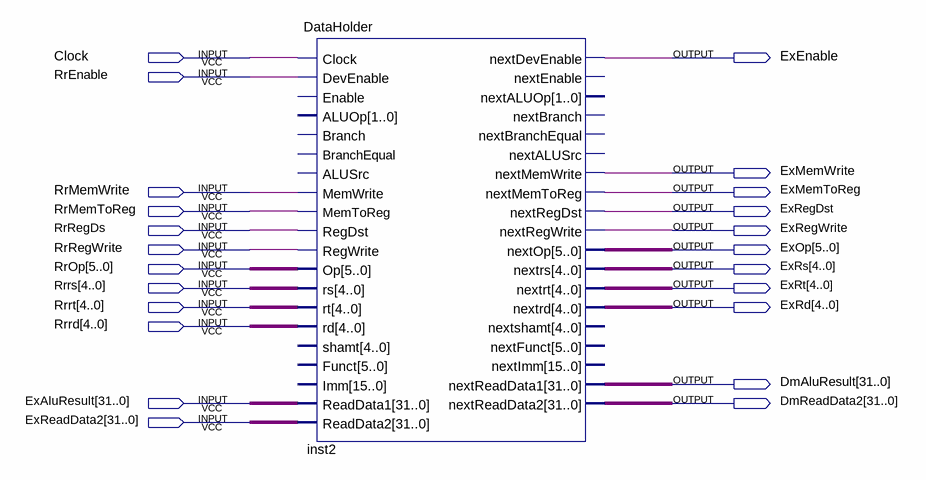
[diagram p0: schematic sheet]
// Quartus schematic ExStage.bdf as structural Verilog: 1 symbols, 23 pins
module ExStage (
  input  Clock,
  input  RrEnable,
  input  RrMemWrite,
  input  RrMemToReg,
  input  RrRegDs,
  input  RrRegWrite,
  input  [5:0] RrOp,
  input  [4:0] Rrrs,
  input  [4:0] Rrrt,
  input  [4:0] Rrrd,
  input  [31:0] ExAluResult,
  input  [31:0] ExReadData2,
  output ExEnable,
  output ExMemWrite,
  output ExMemToReg,
  output ExRegDst,
  output ExRegWrite,
  output [5:0] ExOp,
  output [4:0] ExRs,
  output [4:0] ExRt,
  output [4:0] ExRd,
  output [31:0] DmAluResult,
  output [31:0] DmReadData2
);

  DataHolder inst2 (
    .Clock(Clock), .DevEnable(RrEnable), .MemWrite(RrMemWrite), .MemToReg(RrMemToReg), .RegDst(RrRegDs),
    .RegWrite(RrRegWrite), .Op(RrOp), .rs(Rrrs), .rt(Rrrt), .rd(Rrrd), .ReadData1(ExAluResult),
    .ReadData2(ExReadData2), .nextDevEnable(ExEnable), .nextMemWrite(ExMemWrite), .nextMemToReg(ExMemToReg),
    .nextRegDst(ExRegDst), .nextRegWrite(ExRegWrite), .nextOp(ExOp), .nextrs(ExRs), .nextrt(ExRt),
    .nextrd(ExRd), .nextReadData1(DmAluResult), .nextReadData2(DmReadData2));  // open: Enable, ALUOp, Branch, BranchEqual, ALUSrc, shamt, Funct, Imm, nextEnable, nextALUOp, nextBranch, nextBranchEqual, nextALUSrc, nextshamt, nextFunct, nextImm
endmodule
